# EAGLE design board (EAGLE 6.4)
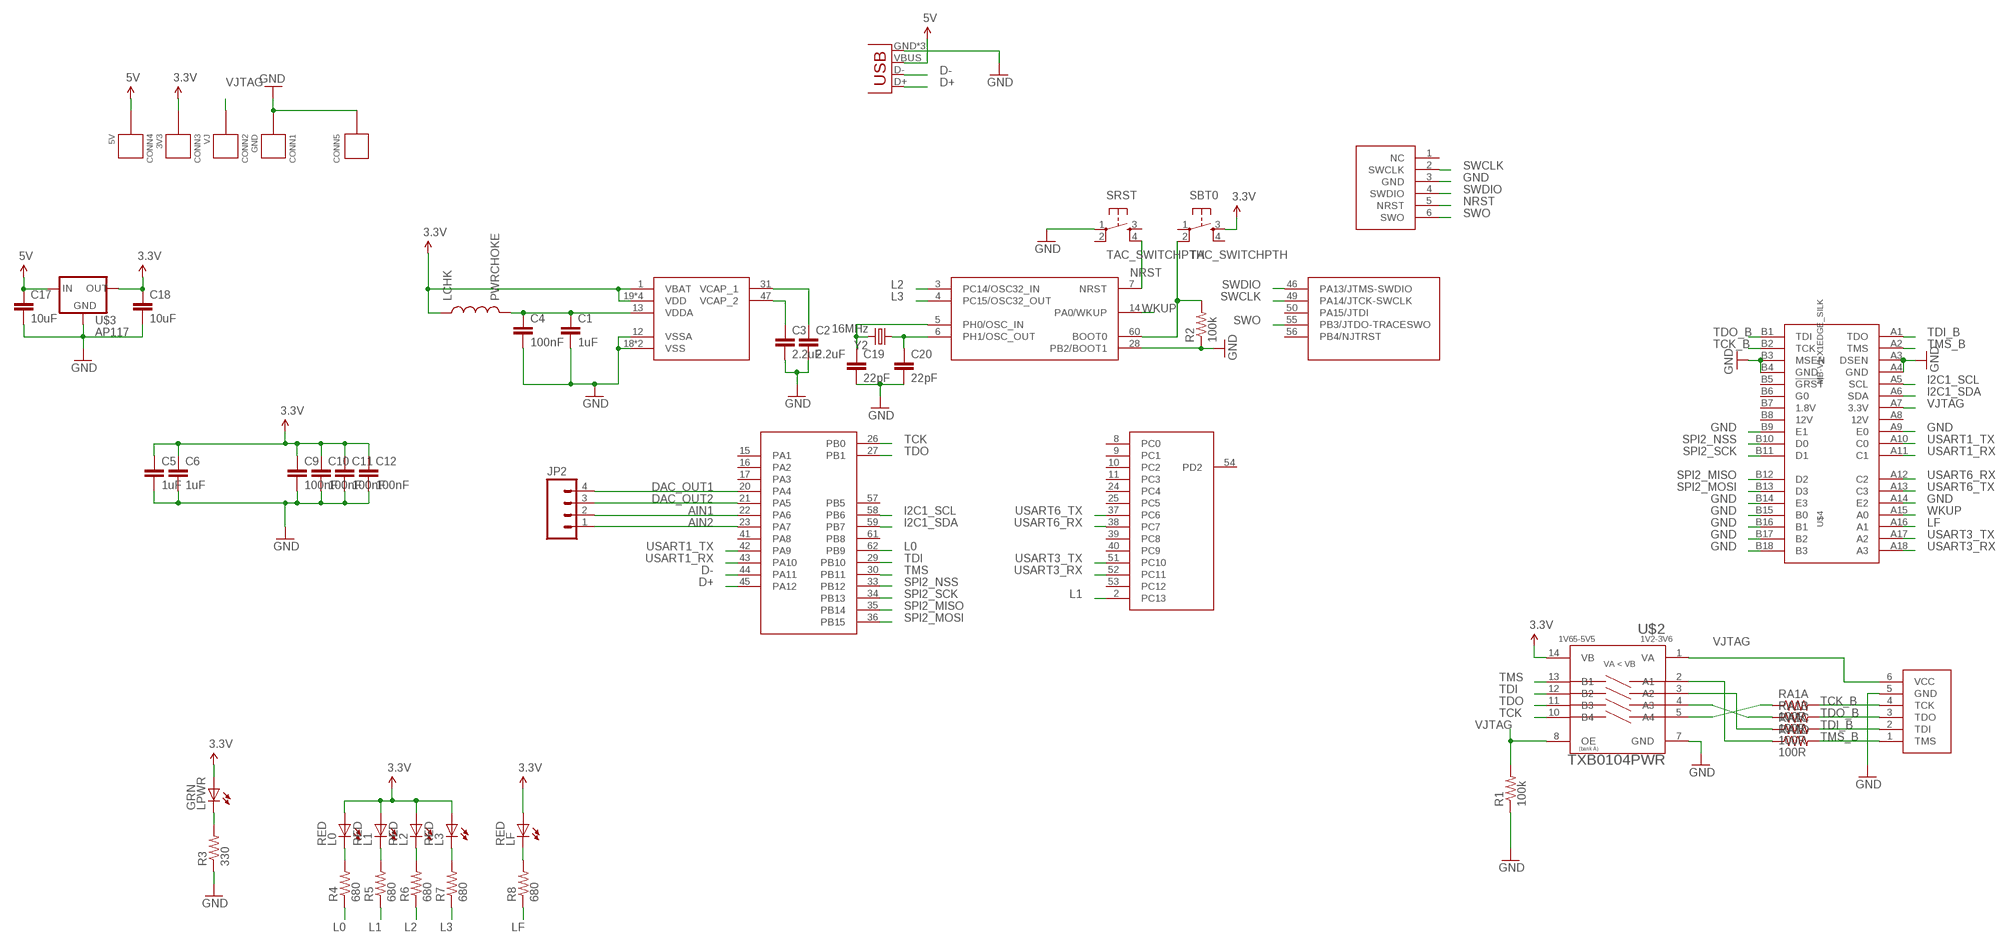
[diagram p0: schematic, sheet 1]

## Parts
C1  1uF  CAP0603  [0603-CAP]
C2  2.2uF  CAP0603  [0603-CAP]
C3  2.2uF  CAP0603  [0603-CAP]
C4  100nF  CAP0402-CAP  [0402-CAP]
C5  1uF  CAP0603  [0603-CAP]
C6  1uF  CAP0603  [0603-CAP]
C9  100nF  CAP0402-CAP  [0402-CAP]
C10  100nF  CAP0402-CAP  [0402-CAP]
C11  100nF  CAP0402-CAP  [0402-CAP]
C12  100nF  CAP0402-CAP  [0402-CAP]
C17  10uF  CAP0805  [0805]
C18  10uF  CAP0805  [0805]
C19  22pF  CAP0402-CAP  [0402-CAP]
C20  22pF  CAP0402-CAP  [0402-CAP]
CONN1  GND  CONNECTOR22AWG  [HOLE_22AWG]
CONN2  VJ  CONNECTOR22AWG  [HOLE_22AWG]
CONN3  3V3  CONNECTOR22AWG  [HOLE_22AWG]
CONN4  5V  CONNECTOR22AWG  [HOLE_22AWG]
CONN5  CONNECTORCLIP  [CLIP-AREA]
JP1  USB-MICROB  [USB-MICROB]
JP2  M04PTH  [1X04]
L0  RED  LED0603  [0603_LED]
L1  RED  LED0603  [0603_LED]
L2  RED  LED0603  [0603_LED]
L3  RED  LED0603  [0603_LED]
LCHK  PWRCHOKE  INDUCTOR0603  [0603]
LF  RED  LED0603  [0603_LED]
LPWR  GRN  LED0603  [0603_LED]
R1  100k  RESISTOR0603  [0603-RES]
R2  100k  RESISTOR0603  [0603-RES]
R3  330  RESISTOR0603  [0603-RES]
R4  680  RESISTOR0603  [0603-RES]
R5  680  RESISTOR0603  [0603-RES]
R6  680  RESISTOR0603  [0603-RES]
R7  680  RESISTOR0603  [0603-RES]
R8  680  RESISTOR0603  [0603-RES]
RA1  100R  RESISTOR_ARRAY0603_X4  [0603-ARV]
SBT0  TAC_SWITCHPTH  [TACTILE-PTH]
SRST  TAC_SWITCHPTH  [TACTILE-PTH]
U$1  STM32F407R  [TQFP64_LONGPAD]
U$2  TXB0104PWR  [TSSOP14]
U$3  AP117  VREGSOT223  [SOT223]
U$4  MB-V1-X1EDGE_SILK  [MB-V1-X1-EDGE]
U$5  JTAGDIGILENT  [1X06]
U$6  STLINK  [1X06]
Y2  16MHz  CRYSTALHC49US  [HC49US]

## Nets
3.3V: C5.1 C6.1 C9.1 C10.1 C11.1 C12.1 C18.1 CONN3.P L0.A L1.A L2.A L3.A LCHK.1 LF.A LPWR.A SBT0.3 U$1.1(VBAT) U$1.19(VDD) U$1.32(VDD) U$1.48(VDD) U$1.64(VDD) U$2.14(VB) U$3.2(OUT) U$3.4(OUT)
5V: C17.1 CONN4.P JP1.VBUS U$3.3(IN)
AIN1: JP2.2 U$1.22(PA6)
AIN2: JP2.1 U$1.23(PA7)
BOOT0: R2.2 SBT0.2 U$1.60(BOOT0)
D+: JP1.D+ U$1.45(PA12)
D-: JP1.D- U$1.44(PA11)
DAC_OUT1: JP2.4 U$1.20(PA4)
DAC_OUT2: JP2.3 U$1.21(PA5)
GND: C1.2 C2.2 C3.2 C4.2 C5.2 C6.2 C9.2 C10.2 C11.2 C12.2 C17.2 C18.2 C19.2 C20.2 CONN1.P CONN5.P$1(P) CONN5.P$2(P) JP1.GND JP1.MT1(GND) JP1.MT2(GND) R1.1 R2.1 R3.1 SRST.1 U$1.12(VSSA) U$1.18(VSS) U$1.28(PB2/BOOT1) U$1.63(VSS) U$2.7(GND) U$3.1(GND) U$4.A3(DSEN) U$4.A4(GND) U$4.A9(E0) U$4.A14(E2) U$4.B3(MSEN) U$4.B4(GND) U$4.B9(E1) U$4.B14(E3) U$4.B15(B0) U$4.B16(B1) U$4.B17(B2) U$4.B18(B3) U$5.5(GND) U$6.3(GND)
I2C1_SCL: U$1.58(PB6) U$4.A5(SCL)
I2C1_SDA: U$1.59(PB7) U$4.A6(SDA)
L0: R4.1 U$1.62(PB9)
L1: R5.1 U$1.2(PC13)
L2: R6.1 U$1.3(PC14/OSC32_IN)
L3: R7.1 U$1.4(PC15/OSC32_OUT)
LF: R8.1 U$4.A16(A1)
N$1: C3.1 U$1.47(VCAP_2)
N$2: C2.1 U$1.31(VCAP_1)
N$4: C19.1 U$1.5(PH0/OSC_IN) Y2.2
N$5: C20.1 U$1.6(PH1/OSC_OUT) Y2.1
N$9: LPWR.C R3.2
N$10: L0.C R4.2
N$11: L1.C R5.2
N$12: L2.C R6.2
N$13: L3.C R7.2
N$19: LF.C R8.2
NRST: SRST.4 U$1.7(NRST) U$6.5(NRST)
SPI2_MISO: U$1.35(PB14) U$4.B12(D2)
SPI2_MOSI: U$1.36(PB15) U$4.B13(D3)
SPI2_NSS: U$1.33(PB12) U$4.B10(D0)
SPI2_SCK: U$1.34(PB13) U$4.B11(D1)
SWCLK: U$1.49(PA14/JTCK-SWCLK) U$6.2(SWCLK)
SWDIO: U$1.46(PA13/JTMS-SWDIO) U$6.4(SWDIO)
SWO: U$1.55(PB3/JTDO-TRACESWO) U$6.6(SWO)
TCK: U$1.26(PB0) U$2.10(B4)
TCK_B: RA1.8 U$4.B2(TCK) U$5.4(TCK)
TCK_O: RA1.1 U$2.5(A4)
TDI: U$1.29(PB10) U$2.12(B2)
TDI_B: RA1.6 U$4.A1(TDO) U$5.2(TDI)
TDI_O: RA1.3 U$2.3(A2)
TDO: U$1.27(PB1) U$2.11(B3)
TDO_B: RA1.7 U$4.B1(TDI) U$5.3(TDO)
TDO_O: RA1.2 U$2.4(A3)
TMS: U$1.30(PB11) U$2.13(B1)
TMS_B: RA1.5 U$4.A2(TMS) U$5.1(TMS)
TMS_O: RA1.4 U$2.2(A1)
USART1_RX: U$1.43(PA10) U$4.A11(C1)
USART1_TX: U$1.42(PA9) U$4.A10(C0)
USART3_RX: U$1.52(PC11) U$4.A18(A3)
USART3_TX: U$1.51(PC10) U$4.A17(A2)
USART6_RX: U$1.38(PC7) U$4.A12(C2)
USART6_TX: U$1.37(PC6) U$4.A13(C3)
VDDA: C1.1 C4.1 LCHK.2 U$1.13(VDDA)
VJTAG: CONN2.P R1.2 U$2.1(VA) U$2.8(OE) U$4.A7(3.3V) U$5.6(VCC)
WKUP: U$1.14(PA0/WKUP) U$4.A15(A0)
Unconnected: SBT0.1 SBT0.4 SRST.2 SRST.3 U$1.8(PC0) U$1.9(PC1) U$1.10(PC2) U$1.11(PC3) U$1.15(PA1) U$1.16(PA2) U$1.17(PA3) U$1.24(PC4) U$1.25(PC5) U$1.39(PC8) U$1.40(PC9) U$1.41(PA8) U$1.50(PA15/JTDI) U$1.53(PC12) U$1.54(PD2) U$1.56(PB4/NJTRST) U$1.57(PB5) U$1.61(PB8) U$4.A8(12V) U$4.B5(!GRST) U$4.B6(G0) U$4.B7(1.8V) U$4.B8(12V) U$6.1(NC)

## Library data of the parts
C1-C6 C9-C12 C17-C20 = kmod-passives:CAP: Capacitor Standard 0603 ceramic capacitor, and 0.1" leaded capacitor.
CONN1-CONN5 = kmod-nonparts:CONNECTOR: Collection of holes/pads for testing/connecting
JP1 = SparkFun-Connectors:USB: USB Connectors USB-B-PTH is fully proven SKU : PRT-00139/CONN-08278 USB-miniB is fully proven SKU : PRT-00587 USB-A-PCB is untested. USB-A-H is throughly reviewed, but untested. Spark Fun Electronics SKU : PRT-00437 USB-B-SMT is throughly reviewed, but untested. Needs silkscreen touching up. USB-A-S has not been used/tested USB-MB-H has not been used/tested USB-MICROB has been used. CONN-09505; PROD_ID: CONN-09505
JP2 = SparkFun-Connectors:M04: Header 4 Standard 4-pin 0.1" header. Use with straight break away headers (SKU : PRT-00116), right angle break away headers (PRT-00553), swiss pins (PRT-00743), machine pins (PRT-00117), and female headers (PRT-00115). Molex polarized connector foot print use with SKU : PRT-08231 with associated crimp pins and housings. 1MM SMD Version SKU: PRT-10208
L0 L1-L3 LF LPWR = kmod-passives:LED
LCHK = SparkFun-Passives:INDUCTOR: Inductors Basic Inductor/Choke - 0603 and 1206. Footprints are not proven and vary greatly between part numbers. SRN6045- 33uH, 20% 1.4A SDR0403-560KL - 56uH, 10%, 500mA RMS/740mA peak
R1-R8 = kmod-passives:RESISTOR: Resistor Basic schematic elements and footprints for 0603, 1206, and PTH resistors.
RA1 = kmod-passives:RESISTOR_ARRAY
SBT0 SRST = kmod-mechanical:TAC_SWITCH: Momentary Switch Button commonly used for reset or general input. Spark Fun Electronics SKU : COM-00097 SMT- SWCH-08247
U$1 = kmod-testing:STM32F407R
U$2 = kmod-ics:TXB0104: TI 4-bit bidirectional voltage translator
U$3 = kmod-ics:VREG
U$4 = kmod-connectors:MB-V1-X1
U$5 = kmod-connectors:JTAG: JTAG connector, as on the Digilent Nexys3
U$6 = kmod-connectors:STLINK
Y2 = kmod-mechanical:CRYSTAL: Various standard crystals. Proven footprints. Spark Fun Electronics SKU : COM-00534

## Board
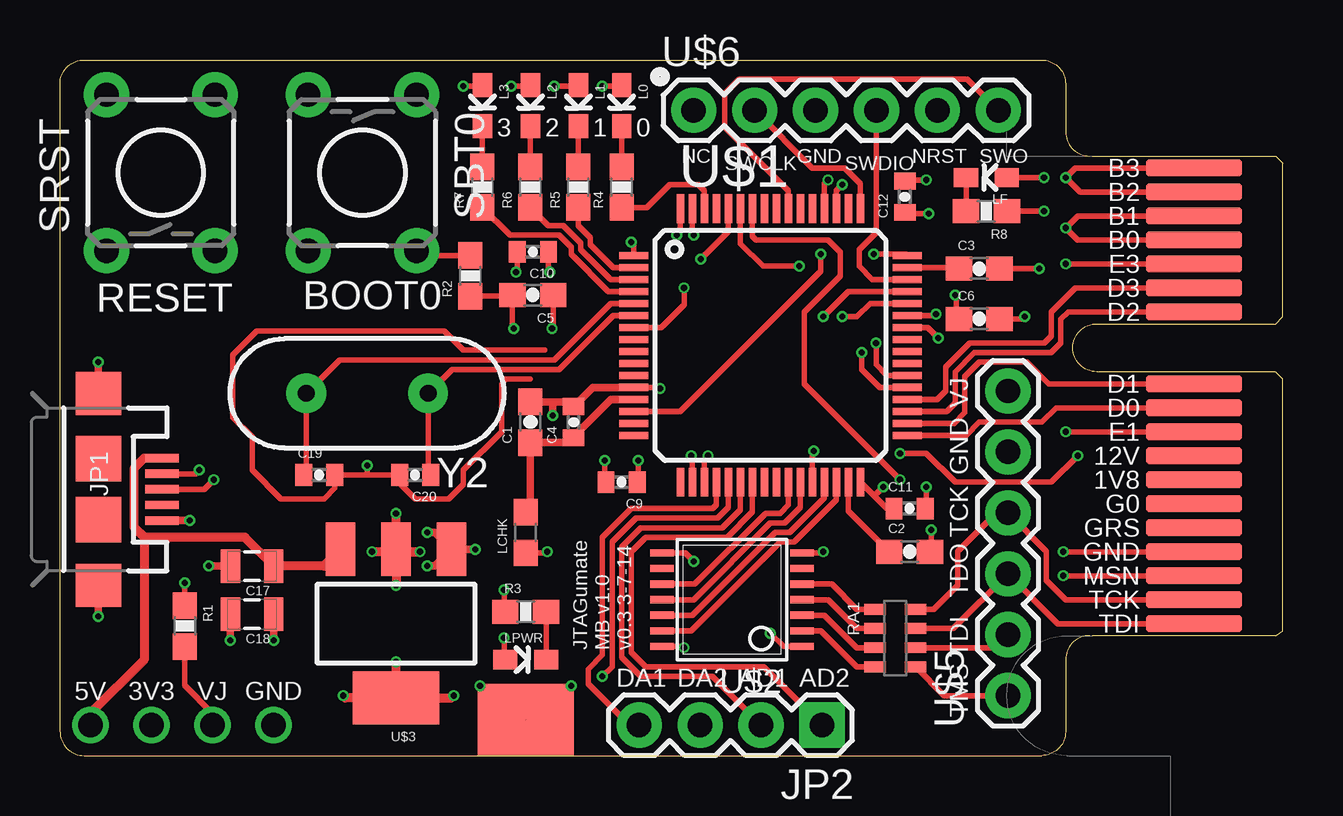
[diagram p1: board, top side]
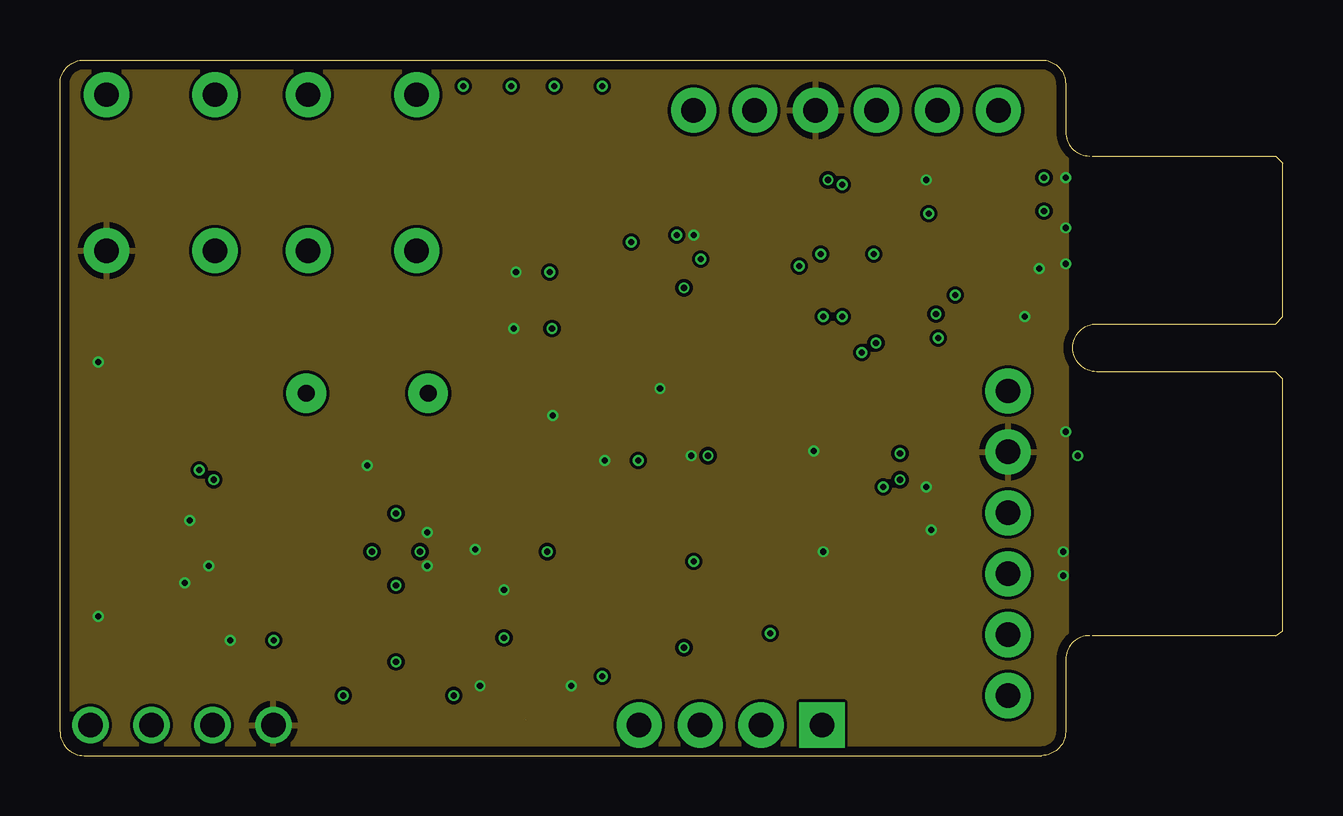
[diagram p2: board, inner layer Route2]
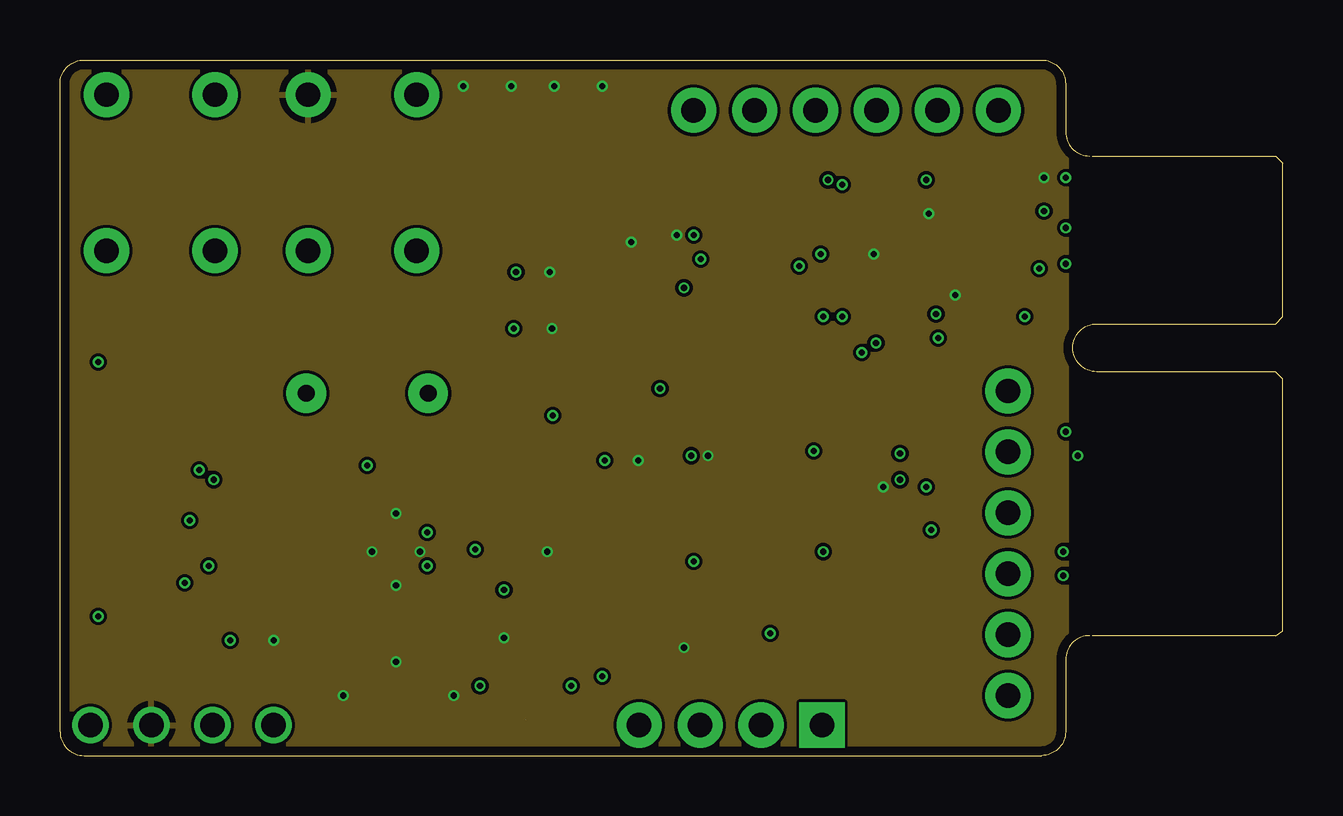
[diagram p3: board, inner layer Route15]
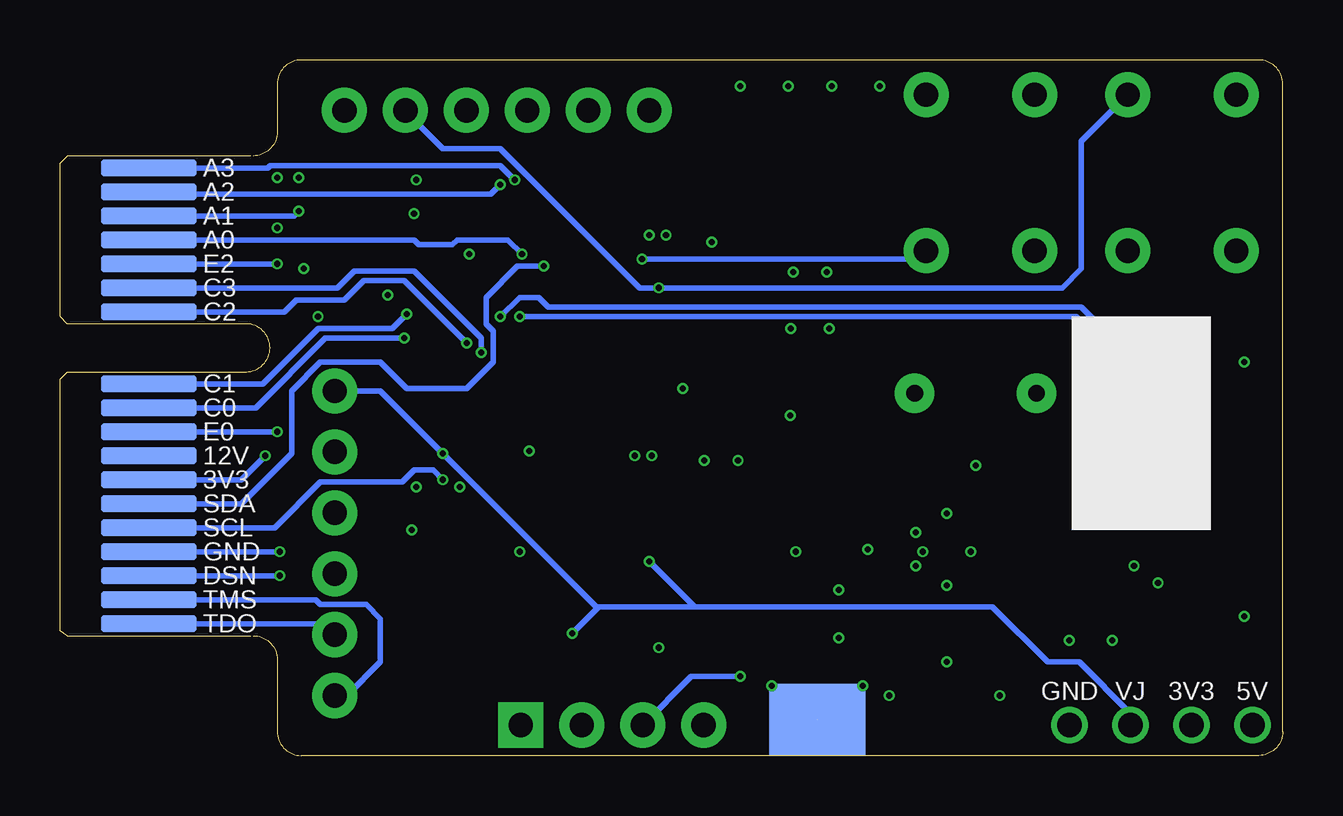
[diagram p4: board, bottom side, seen from below]

Size 50.95 x 29 mm. Coordinates in mm from the lower left corner, seen from the top.
Outline: 42.9,5 arc90 41.9,4 41.9,1 arc-90 40.9,0 1,0 arc-90 0,1 0,28 arc-90 1,29 40.9,29 arc-90 41.9,28 41.9,26 arc90 42.9,25
Copper layers (1+2*15+16): Top 0.0356mm / dielectric 0.17mm / Route2 0.0178mm / dielectric 1.1941mm / Route15 0.0178mm / dielectric 0.17mm / Bottom 0.0356mm
Design rules "OSHPark_mine_4layer *": minimum track width 5mil, minimum drill 10mil, track to track 5mil, track to pad 5mil, pad to pad 5mil, via to via 5mil, smd to smd 5mil, copper to edge 15mil, drill to drill 6mil, minimum pad ring 4mil, minimum via ring 4mil, stop-mask expansion 2mil, vias tented up to drill 13mil, thermal gap 10mil

### Footprints (pad centres in the part's own frame; a part is rotated, then mirrored left to right if it is on the bottom)
0603-CAP = smd 1.1 x 1: 1 -0.85,0; 2 0.85,0
0402-CAP = smd 0.7 x 0.9: 1 -0.65,0; 2 0.65,0
0805 = smd 0.8 x 1.4: 1 -0.9,0; 2 0.9,0
HOLE_22AWG = drill 1.016: P 0,0
CLIP-AREA = smd 4 x 3: P$1 0,0 | smd 4 x 3 bottom: P$2 0,0
USB-MICROB = smd 0.35 x 1.4: D+ 0,2.65; D- -0.65,2.65; GND 1.3,2.65; ID 0.65,2.65; VBUS -1.3,2.65 | smd 1.8 x 1.9: MT1 -4,0; MT2 4,0 | smd 1.9 x 1.9: P$1 -1.27,0; P$2 1.27,0
1X04 = drill 1.016 pad 1.88 square: 1 0,0 | drill 1.016 pad 1.88: 2 2.54,0; 3 5.08,0; 4 7.62,0
0603_LED = smd 0.8 x 1.003: A 0,-0.852; C 0,0.852
0603 = smd 1.1 x 1: 1 -0.85,0; 2 0.85,0
0603-RES = smd 1.1 x 1: 1 -0.85,0; 2 0.85,0
0603-ARV = smd 0.45 x 0.9: 1 -1.2,-0.85; 2 -0.4,-0.85; 3 0.4,-0.85; 4 1.2,-0.85; 5 1.2,0.85; 6 0.4,0.85; 7 -0.4,0.85; 8 -1.2,0.85
TACTILE-PTH = drill 1.016 pad 1.88: 1 -3.251,2.261; 2 3.251,2.261; 3 -3.251,-2.261; 4 3.251,-2.261
TQFP64_LONGPAD = smd 1.2 x 0.3: 1 -5.7,3.75; 2 -5.7,3.25; 3 -5.7,2.75; 4 -5.7,2.25; 5 -5.7,1.75; 6 -5.7,1.25; 7 -5.7,0.75; 8 -5.7,0.25; 9 -5.7,-0.25; 10 -5.7,-0.75; 11 -5.7,-1.25; 12 -5.7,-1.75; 13 -5.7,-2.25; 14 -5.7,-2.75; 15 -5.7,-3.25; 16 -5.7,-3.75; 33 5.7,-3.75; 34 5.7,-3.25; 35 5.7,-2.75; 36 5.7,-2.25; 37 5.7,-1.75; 38 5.7,-1.25; 39 5.7,-0.75; 40 5.7,-0.25; 41 5.7,0.25; 42 5.7,0.75; 43 5.7,1.25; 44 5.7,1.75; 45 5.7,2.25; 46 5.7,2.75; 47 5.7,3.25; 48 5.7,3.75 | smd 0.3 x 1.2: 17 -3.75,-5.7; 18 -3.25,-5.7; 19 -2.75,-5.7; 20 -2.25,-5.7; 21 -1.75,-5.7; 22 -1.25,-5.7; 23 -0.75,-5.7; 24 -0.25,-5.7; 25 0.25,-5.7; 26 0.75,-5.7; 27 1.25,-5.7; 28 1.75,-5.7; 29 2.25,-5.7; 30 2.75,-5.7; 31 3.25,-5.7; 32 3.75,-5.7; 49 3.75,5.7; 50 3.25,5.7; 51 2.75,5.7; 52 2.25,5.7; 53 1.75,5.7; 54 1.25,5.7; 55 0.75,5.7; 56 0.25,5.7; 57 -0.25,5.7; 58 -0.75,5.7; 59 -1.25,5.7; 60 -1.75,5.7; 61 -2.25,5.7; 62 -2.75,5.7; 63 -3.25,5.7; 64 -3.75,5.7
TSSOP14 = smd 0.305 x 0.991: 1 -1.95,-2.918; 2 -1.3,-2.918; 3 -0.65,-2.918; 4 0,-2.918; 5 0.65,-2.918; 6 1.3,-2.918; 7 1.95,-2.918; 8 1.95,2.918; 9 1.3,2.918; 10 0.65,2.918; 11 0,2.918; 12 -0.65,2.918; 13 -1.3,2.918; 14 -1.95,2.918
SOT223 = smd 1.219 x 2.235: 1 -2.311,-3.099; 2 0,-3.099; 3 2.311,-3.099 | smd 3.6 x 2.2: 4 0,3.099
MB-V1-X1-EDGE = smd 0.7 x 4 bottom: A1 -11.5,-0.75; A2 -10.5,-0.75; A3 -9.5,-0.75; A4 -8.5,-0.75; A5 -7.5,-0.75; A6 -6.5,-0.75; A7 -5.5,-0.75; A8 -4.5,-0.75; A9 -3.5,-0.75; A10 -2.5,-0.75; A11 -1.5,-0.75; A12 1.5,-0.75; A13 2.5,-0.75; A14 3.5,-0.75; A15 4.5,-0.75; A16 5.5,-0.75; A17 6.5,-0.75; A18 7.5,-0.75 | smd 0.7 x 4: B1 -11.5,-0.75; B2 -10.5,-0.75; B3 -9.5,-0.75; B4 -8.5,-0.75; B5 -7.5,-0.75; B6 -6.5,-0.75; B7 -5.5,-0.75; B8 -4.5,-0.75; B9 -3.5,-0.75; B10 -2.5,-0.75; B11 -1.5,-0.75; B12 1.5,-0.75; B13 2.5,-0.75; B14 3.5,-0.75; B15 4.5,-0.75; B16 5.5,-0.75; B17 6.5,-0.75; B18 7.5,-0.75
1X06 = drill 1.016 pad 1.88: 1 0,0; 2 2.54,0; 3 5.08,0; 4 7.62,0; 5 10.16,0; 6 12.7,0
HC49US = drill 0.7 pad 1.651: 1 -2.54,0; 2 2.54,0

### Placement (x,y rotation side)
C1  19.6,13.9 90 top
C2  35.4,8.5 0 top
C3  38.3,20.3 0 top
C4  21.4,13.9 90 top
C5  19.7,19.2 180 top
C6  38.3,18.2 0 top
C9  23.4,11.4 180 top
C10  19.7,21 180 top
C11  35.4,10.3 0 top
C12  35.2,23.3 90 top
C17  8,7.9 180 top
C18  8,5.9 180 top
C19  10.8,11.7 0 top
C20  14.8,11.7 180 top
CONN1  8.89,1.27 180 top
CONN2  6.35,1.27 180 top
CONN3  3.81,1.27 180 top
CONN4  1.27,1.27 180 top
CONN5  19.4,1.5 0 bottom
JP1  1.6,11.1 270 top
JP2  31.75,1.27 180 top
L0  23.4,27.1 180 top
L1  21.6,27.1 180 top
L2  19.6,27.1 180 top
L3  17.6,27.1 180 top
LCHK  19.4,9.3 90 top
LF  38.6,24.1 90 top
LPWR  19.4,4 270 top
R1  5.2,5.4 270 top
R2  17.1,20 90 top
R3  19.4,6 0 top
R4  23.4,23.7 90 top
R5  21.6,23.7 90 top
R6  19.6,23.7 90 top
R7  17.6,23.7 90 top
R8  38.6,22.7 180 top
RA1  34.8,4.9 270 top
SBT0  12.6,24.3 270 top
SRST  4.2,24.3 90 top
U$1  29.6,17.1 0 top
U$2  28,6.5 90 top
U$3  14,5.5 180 top
U$4  46.5,17 90 top
U$5  39.5,2.5 90 top
U$6  26.4,26.9 0 top
Y2  12.8,15.1 180 top

### Tracks (layer width: path | path; a pad name or v marks a point on that pad's centre or on a via)
3.3V  (via drill 0.25)
  Top 0.229: L3.A 17.6,27.9 v16.8,27.9 | L2.A 19.6,27.9 v18.8,27.9 | L0.A 23.4,27.9 v22.6,27.9 | U$2.14 25.95,4.55 v26,4.5 | LPWR.A 18.5,3.95 v18.5,4.9 | C9.1 24.1,11.45 v24.1,12.3 | U$1.19 26.85,12.35 v27,12.5 | LCHK.1 20.25,8.45 v20.3,8.5 | C5.1 20.55,17.85 v20.5,17.8 | C10.1 20.35,20.2 v20.4,20.15 | U$1.1 23.9,21.3 v23.8,21.4 | U$1.64 25.85,21.85 v25.7,21.7 | C11.1 34.45,10.3 33.93,10.82 | 33.93,10.82 U$1.32 | 33.93,10.82 33.93,10.83 v34.3,11.2 | LF.A v41,24.1 | C6.1 37.35,18.3 37.35,19.15 v37.3,19.2 | U$1.48 35.25,20.9 v33.9,20.9 | C12.1 35.25,22.6 v36.2,22.6 | v20.6,27.9 21.55,27.9 L1.A
  Top 0.305: C18.1 v8.9,4.8
  Top 0.381: U$3.4 16.3,2.4 v16.4,2.5 | U$3.4 11.9,2.4 v11.8,2.5 | U$3.4 v14,3.9 | 14,8.5 U$3.2 v14,10.1 | 14,8.5 v14,7.1 | 14,8.5 v15,8.5 v13,8.5
  pour Route15: 0,29 41.9,29 41.9,0 0,0
5V
  Top 0.381: U$3.3 10.99,7.9 C17.1 7.7,9.1 3.5,9.1 | 3.5,9.1 3.1,9.5 3.1,12 3.5,12.4 JP1.VBUS | 3.5,9.1 3.5,4 1.27,1.77 CONN4.P
AIN1
  Top 0.229: U$1.22 28.35,10.25 27.6,9.5 24.2,9.5 23.4,8.7 23.4,4.1 24.2,3.3 27.18,3.3 JP2.2
AIN2
  Top 0.229: U$1.23 28.85,10.15 27.8,9.1 24.4,9.1 23.8,8.5 23.8,4.3 24.4,3.7 29.32,3.7 JP2.1
BOOT0  (via drill 0.25)
  Top 0.229: SBT0.2 15.06,20.85 R2.2 | U$1.60 27.85,21.85 v26.7,20.7
  Bottom 0.229: v26.7,20.7 15.21,20.7 SBT0.2
D+  (via drill 0.25)
  Top 0.229: JP1.D+ 6,11.1 v6.4,11.5 | v31.8,18.3 32.85,19.35 U$1.45
  Bottom 0.229: v6.4,11.5 6.4,16.1 8.6,18.3 v31.8,18.3
D-  (via drill 0.25)
  Top 0.229: JP1.D- 5.65,11.75 v5.8,11.9 | U$1.44 33.75,18.85 33.2,18.3 v32.6,18.3
  Bottom 0.229: v32.6,18.3 31.8,19.1 31,19.1 30.6,18.7 8.4,18.7 6,16.3 6,12.1 v5.8,11.9
DAC_OUT1
  Top 0.229: U$1.20 27.35,10.45 27.2,10.3 23.8,10.3 22.6,9.1 22.6,4.2 22,3.6 22,3 23.73,1.27 JP2.4
DAC_OUT2  (via drill 0.25)
  Top 0.229: U$1.21 27.85,10.35 27.4,9.9 24,9.9 23,8.9 23,3.7 v22.6,3.3
  Bottom 0.229: v22.6,3.3 24.64,3.3 JP2.3
GND  (via drill 0.25)  (1 unrouted)
  Top 0.229: 12.8,11.7 C19.2 11.45,11.15 11,10.7 9.2,10.7 8,11.9 8,13.3 7.2,14.1 7.2,16.7 8.2,17.7 16,17.7 16.8,16.9 20.2,16.9 | 12.8,11.7 C20.2 14.15,11.35 14.8,10.7 16.2,10.7 16.8,11.3 16.8,11.9 18.4,13.5 18.4,15.5 18.6,15.7 19.6,15.7 | U$2.7 31.75,8.45 v31.8,8.5 | U$1.28 31.35,12.65 v31.4,12.7 | U$1.12 24.95,15.35 v25,15.3 | U$1.63 26.35,21.75 v26.4,21.7 | U$1.18 26.35,12.45 v26.3,12.5 | 21.2,14.75 C4.2 | 12.8,11.7 v12.8,12.1 | R1.1 v5.2,7.2 | R3.1 18.5,6.05 v18.5,6.9 | C9.2 22.7,11.45 v22.7,12.3 | v18.9,17.8 18.85,17.85 C5.2 18.8,19.15 R2.1 | C10.2 19.05,20.2 v19,20.15 | U$4.B3 v41.8,7.5 | v41.8,8.5 U$4.B4 | C2.2 36.3,8.55 v36.3,9.4 | C11.2 36.1,10.35 v36.1,11.2 | C3.2 v40.8,20.3 | C12.2 35.25,24 v36.1,24 | U$4.A9 v41.9,13.5 | v41.9,20.5 U$4.A14 | C6.2 40.1,18.2 v40.2,18.3 | U$4.B18 42.3,24.5 v41.9,24.1 42.5,23.5 U$4.B17 | U$4.B16 42.4,22.5 v41.9,22 42.4,21.5 U$4.B15
  Top 0.305: C1.2 21.2,14.75 | U$1.12 22.2,15.35 C4.2 | C18.2 v7.1,4.8 | C17.2 v6.2,7.9 | JP1.MT2 v1.6,5.8 | JP1.GND v5.4,9.8 | JP1.MT1 v1.6,16.4 | U$3.1 v17.3,8.6 | U$3.1 15.61,9.3 v15.3,9.3 | U$3.1 15.61,7.9 v15.3,7.9 | v20.53,14.17 20.53,14.63 20.6,14.7
  Bottom 0.229: v41.8,7.5 U$4.B3 | U$4.B4 v41.8,8.5 | v41.9,13.5 U$4.A9 | U$4.A14 v41.9,20.5 | v17.5,2.9 18.9,1.5 CONN5.P$2
  other vias: 21.3,2.9
  pour Route2: 0,29 41.9,29 41.9,0 0,0
I2C1_SCL  (via drill 0.25)
  Top 0.229: U$1.58 28.85,21.65 29,21.5 32,21.5 32.5,21 32.5,20 31,18.5 31,15.5 v35,11.5
  Bottom 0.229: v35,11.5 35.4,11.9 36.2,11.9 36.7,11.4 40.1,11.4 42,9.5 U$4.A5
I2C1_SDA  (via drill 0.25)
  Top 0.229: U$1.59 28.35,21.35 29.3,20.4 v30.8,20.4
  Bottom 0.229: U$4.A6 43.4,10.5 41.3,12.6 41.3,15.2 40.1,16.4 37.6,16.4 36.5,15.3 34,15.3 32.9,16.4 32.9,17.7 33.2,18 33.2,19.1 31.9,20.4 v30.8,20.4
L0
  Top 0.229: R4.1 24.45,22.85 25.4,23.8 26.6,23.8 26.85,23.55 U$1.62
L1
  Top 0.229: U$1.2 23.05,20.35 22.1,21.3 22.1,21.6 21.6,22.1 R5.1
L2
  Top 0.229: U$1.3 22.95,19.85 21.7,21.1 21.7,21.36 20.96,22.1 20.35,22.1 R6.1
L3
  Top 0.229: U$1.4 22.85,19.35 21.3,20.9 21.3,21.2 20.8,21.7 18.75,21.7 R7.1
LF  (via drill 0.25)
  Top 0.229: R8.1 v41,22.7
  Bottom 0.229: v41,22.7 41.2,22.5 U$4.A16
N$1
  Top 0.229: U$1.47 37.4,20.35 C3.1
N$2
  Top 0.229: C2.1 32.85,10.2 U$1.31
N$4
  Top 0.229: U$1.5 22.95,18.85 20.6,16.5 11.66,16.5 Y2.2 10.26,11.81 C19.1
N$5
  Top 0.229: U$1.6 23.05,18.35 20.8,16.1 16.34,16.1 Y2.1 15.34,11.81 C20.1
N$9
  Top 0.229: R3.2 LPWR.C
N$10
  Top 0.229: L0.C R4.2
N$11
  Top 0.229: L1.C R5.2
N$12
  Top 0.229: L2.C R6.2
N$13
  Top 0.229: L3.C R7.2
N$19
  Top 0.229: LF.C R8.2
NRST  (via drill 0.25)
  Top 0.229: U$1.7 25.05,17.85 26,18.8 v26,19.5
  Bottom 0.229: SRST.4 8.4,25.61 8.4,20.3 9.2,19.5 v26,19.5 26.8,19.5 32.6,25.3 35,25.3 36.56,26.86 U$6.5
SPI2_MISO
  Top 0.229: U$4.B12 42,18.5 41.7,18.2 41.7,17.2 41.3,16.8 38.1,16.8 37.3,16 37.3,14.7 36.95,14.35 U$1.35
SPI2_MOSI
  Top 0.229: U$4.B13 42.3,19.5 41.3,18.5 41.3,17.5 41,17.2 37.9,17.2 36.9,16.2 36.9,15.2 36.55,14.85 U$1.36
SPI2_NSS
  Top 0.229: U$1.33 37.75,13.35 38.3,13.9 40.9,13.9 41.5,14.5 U$4.B10
SPI2_SCK
  Top 0.229: U$1.34 37.25,13.85 37.7,14.3 37.7,15.8 38.3,16.4 40.3,16.4 41.2,15.5 U$4.B11
SWCLK
  Top 0.229: U$6.2 31.34,24.5 32.7,24.5 33.35,23.85 U$1.49
SWDIO
  Top 0.229: U$6.4 34,26.88 34,21.8 33.3,21.1 33.3,20.4 33.85,19.85 U$1.46
SWO
  Top 0.229: U$6.6 37.8,28.2 28.3,28.2 27.7,27.6 27.7,26.2 30.35,23.55 U$1.55
TCK
  Top 0.229: U$1.26 30.35,10.45 30,10.1 29.4,10.1 26.45,7.15 U$2.10
TCK_B
  Top 0.229: RA1.8 36.4,6.1 37.4,7.1 37.4,8.52 39,10.12 U$5.4 41.1,8.52 41.1,7.3 41.9,6.5 U$4.B2
TCK_O
  Top 0.229: U$2.5 32.15,7.15 33.2,6.1 RA1.1
TDI
  Top 0.229: U$1.29 31.85,10.75 30.4,9.3 29.8,9.3 26.35,5.85 U$2.12
TDI_B
  Top 0.229: RA1.6 38.96,4.5 U$5.2
  Bottom 0.229: U$4.A1 39.96,5.5 U$5.2
TDI_O
  Top 0.229: U$2.3 31.85,5.85 33.2,4.5 RA1.3
TDO
  Top 0.229: U$1.27 30.85,10.35 30.2,9.7 29.6,9.7 26.4,6.5 U$2.11
TDO_B
  Top 0.229: RA1.7 37.22,5.3 U$5.3 41.58,5.5 U$4.B1
TDO_O
  Top 0.229: U$2.4 32,6.5 33.2,5.3 RA1.2
TMS
  Top 0.229: U$1.30 32.35,10.65 30.6,8.9 30,8.9 26.3,5.2 U$2.13
TMS_B
  Top 0.229: RA1.5 36.85,2.5 U$5.1
  Bottom 0.229: U$4.A2 40.3,6.5 40.1,6.3 38.2,6.3 37.6,5.7 37.6,3.9 39,2.5 U$5.1
TMS_O
  Top 0.229: U$2.2 31.7,5.2 33.2,3.7 RA1.4
USART1_RX  (via drill 0.25)
  Top 0.229: U$1.43 36.45,18.35 v36.5,18.4
  Bottom 0.229: v36.5,18.4 37.1,17.8 40.2,17.8 42.5,15.5 U$4.A11
USART1_TX  (via drill 0.25)
  Top 0.229: U$1.42 36.15,17.85 v36.6,17.4
  Bottom 0.229: v36.6,17.4 39.9,17.4 42.8,14.5 U$4.A10
USART3_RX  (via drill 0.25)
  Top 0.229: U$1.52 31.85,23.85 v32,24
  Bottom 0.229: v32,24 32.6,24.6 42.2,24.6 42.3,24.5 U$4.A18
USART3_TX  (via drill 0.25)
  Top 0.229: U$1.51 32.35,23.55 v32.6,23.8
  Bottom 0.229: v32.6,23.8 33,23.4 47.15,23.4 U$4.A17
USART6_RX  (via drill 0.25)
  Top 0.229: U$1.38 34.45,15.85 34,16.3 v34,17.2
  Bottom 0.229: v34,17.2 36.6,19.8 38.3,19.8 39.1,19 41.1,19 41.6,18.5 U$4.A12
USART6_TX  (via drill 0.25)
  Top 0.229: U$1.37 34.15,15.35 33.4,16.1 v33.4,16.8
  Bottom 0.229: v33.4,16.8 33.4,17.4 36.2,20.2 38.7,20.2 39.4,19.5 U$4.A13
VDDA
  Top 0.229: 21.6,13.5 21.6,13.45 C4.1
  Top 0.305: U$1.13 22.95,14.85 21.6,13.5 | C4.1 21.2,13.05 C1.1 19.6,10.35
  Top 0.381: 19.6,10.35 LCHK.2
VJTAG  (via drill 0.25)
  Top 0.229: R1.2 5.2,2.92 6.35,1.77 CONN2.P | v35,12.6 36.1,12.6 37.3,11.4 41.3,11.4 v42.4,12.5 | U$2.8 26.05,8.45 v26.4,8.1 | U$2.1 30.15,4.55 v29.6,5.1
  Bottom 0.229: 24.5,6.2 12.1,6.2 9.8,3.9 8.48,3.9 6.35,1.77 CONN2.P | 24.5,6.2 v26.4,8.1 | 24.5,6.2 28.5,6.2 | 28.5,6.2 v29.6,5.1 | 28.5,6.2 28.6,6.2 v35,12.6 37.6,15.2 U$5.6 | v42.4,12.5 43.4,11.5 U$4.A7
WKUP  (via drill 0.25)
  Top 0.229: U$1.14 25.85,14.35 31.7,20.2 v31.7,20.9
  Bottom 0.229: U$4.A15 36.2,21.5 36,21.3 34.6,21.3 34.4,21.5 32.3,21.5 v31.7,20.9

### Text on the board
tPlace: 3 | 2 | 1 | 0 | NC | GND | NRST | SWO | SWCLK | SWDIO | BOOT0 | RESET | VJ | GND | TCK | TDO | JTAGumate / MB v1.0 / v0.3 3-7-14 | TDI | DA1 | DA2 | AD1 | AD2 | TMS